# Altium schematic sheet device-bps.SchDoc
size 297 x 209 mm
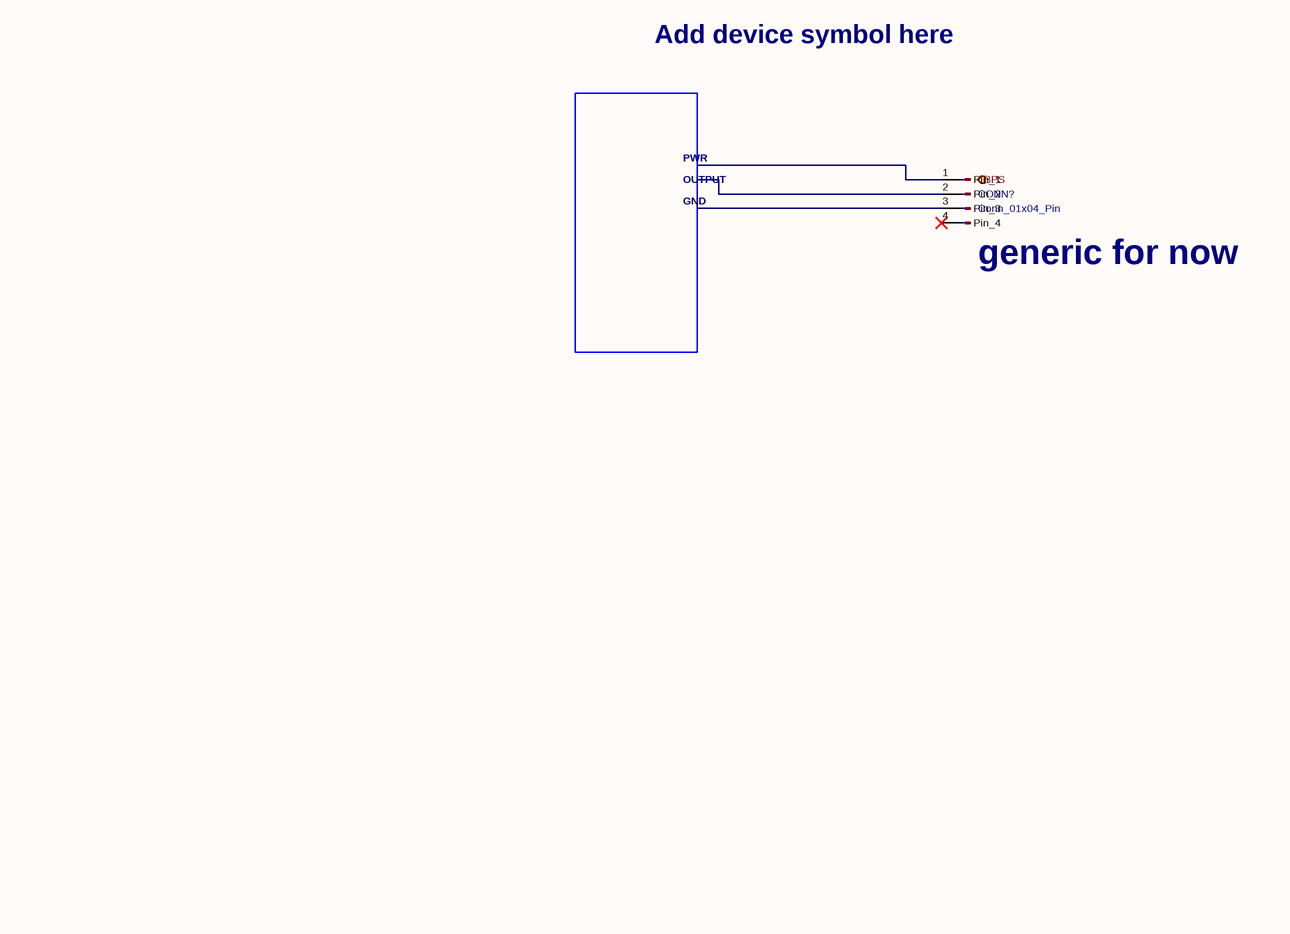
[diagram p0: device-bps.SchDoc]

## Parts
CONN?  Conn_01x04_Pin

## Ports
BPS (out)

## Nets

Not connected (* = marked no-connect by the designer): CONN? 1(Pin_1) 2(Pin_2) 3(Pin_3) 4(Pin_4)*

## Notes on the sheet
- Add device symbol here
- GND
- PWR
- OUTPUT
- (near CONN?) generic for now
- 1
- 2
- 3
- 4
- 5
- 6
- A
- B
- C
- D
- Title: DEVICE - BPS
- File: device-bps.kicad_sch
- Sheet: /
- KiCad E.D.A.  kicad (5.1.4)-1
- Size: A4
- Date:
- Rev:
- Id: 1/1

## Library data of the parts
CONN? = Conn_01x04_Pin: Value: Conn_01x04_Pin